# Altium schematic sheet LISN_Mate.SchDoc
size A4; SheetNumber: 1; SheetTotal: 1
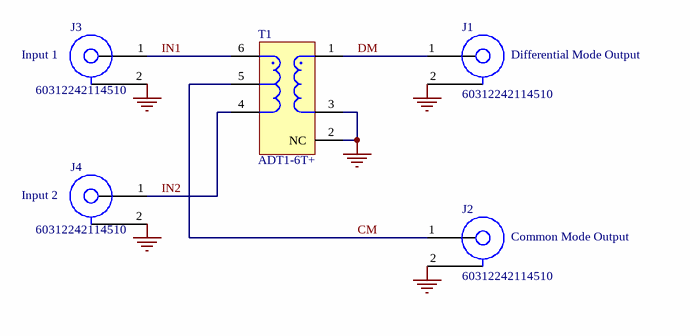
[diagram p0: LISN_Mate.SchDoc]

## Parts
J1  60312242114510  [60312242114510]
J2  60312242114510  [60312242114510]
J3  60312242114510  [60312242114510]
J4  60312242114510  [60312242114510]
T1  ADT1-6T+  [FP-CD637]

## Nets
GND: J1.2(RF_GND) J2.2(RF_GND) J3.2(RF_GND) J4.2(RF_GND) T1.2(NC) T1.3
CM: J2.1(RF) T1.5
DM: J1.1(RF) T1.1
IN1: J3.1(RF) T1.6
IN2: J4.1(RF) T1.4

## Notes on the sheet
- (near J3) Input 1
- (near J1) Differential Mode Output
- (near J4) Input 2
- (near J2) Common Mode Output
- Title:
- Date:
- Customer:
- Drawn by:
- Checked by:
- This drawing and specification is the
- property of Digitrol Ltd. and must not be
- copied or disclosed to a third party
- Drawing Number:
- Rev:
- Size:
- A4
- Sheet
- of
- without the written permission of Digitrol
- Telephone:
- Modification Reference:

## Library data of the parts
J1-J4 = RF-CONNECTOR: Connector - SMA Socket, Right-Angle, PCB Edge Mount, 50 ohm; RoHS Compliant: Yes
T1 = Transformer 1:1 Centre Tap with NC Pin: RF Transformer - ADT1-6T+; Turns Ratio: 1:1; RoHS Compliant: Yes